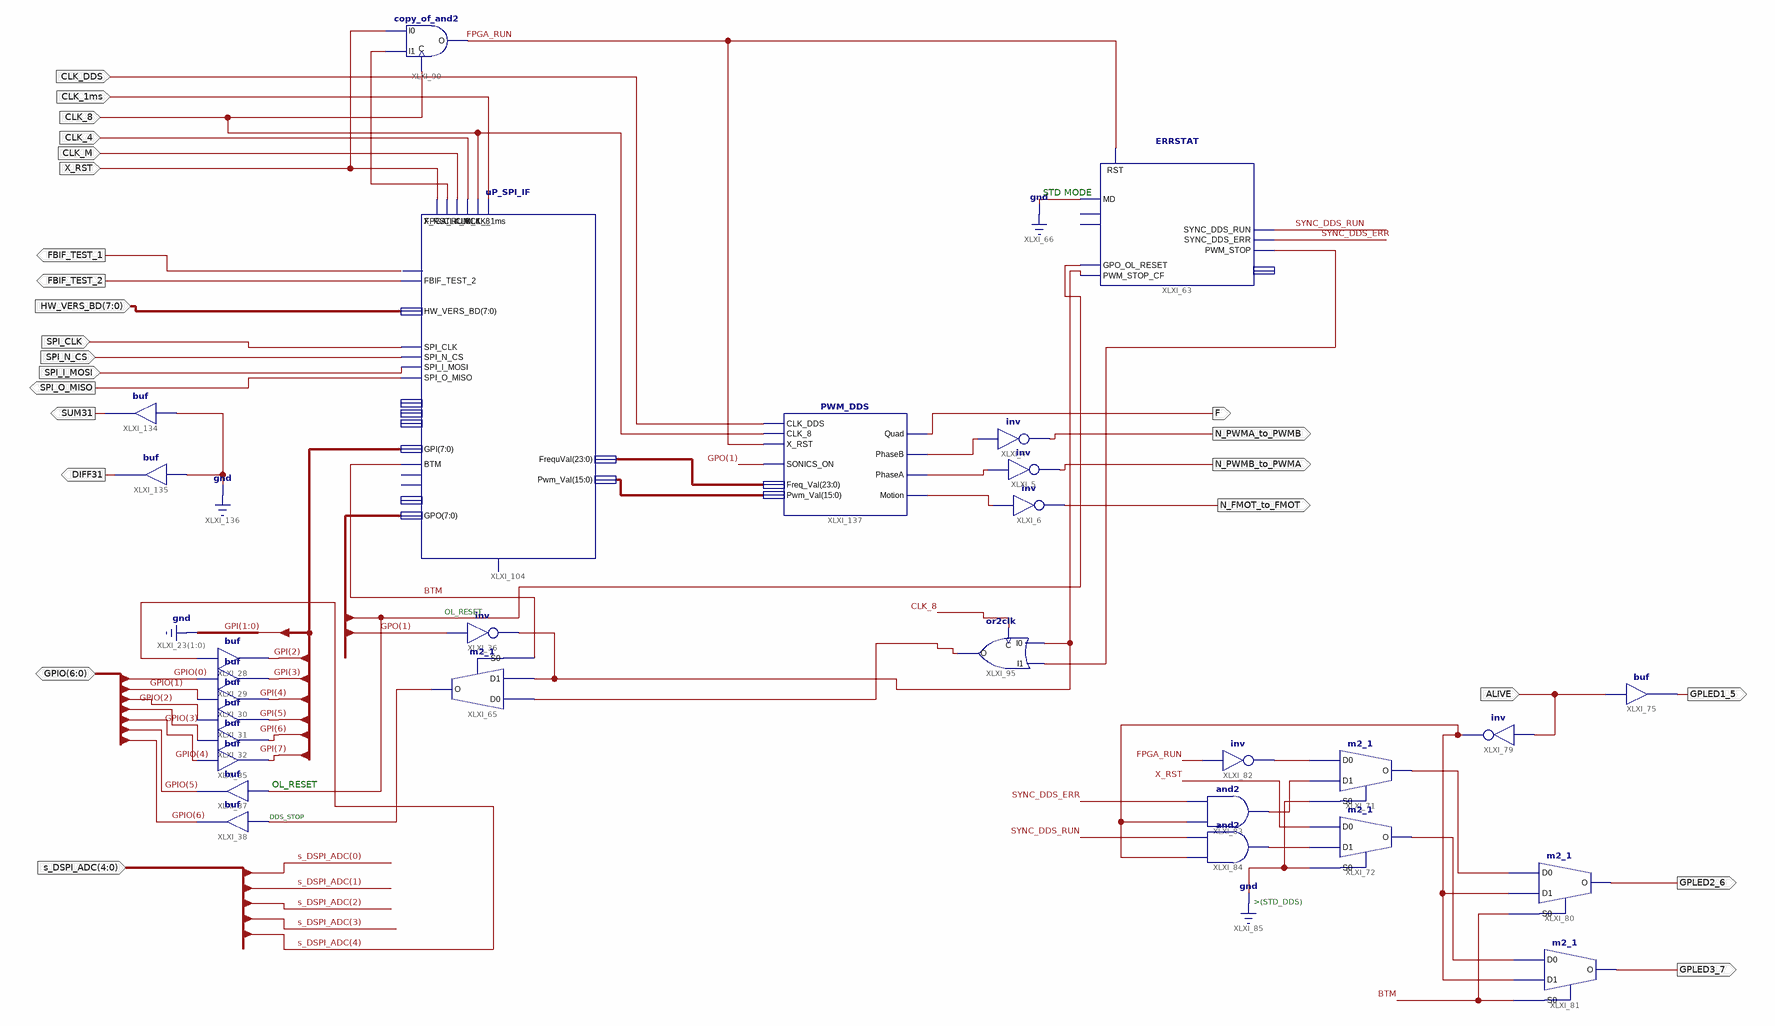
[diagram p0: schematic sheet 1]
// Xilinx ISE schematic FPGA_DUPS_Main.sch (spartan3a) as structural Verilog: 29 symbols, 25 ports
module FPGA_DUPS_Main (
  input  X_RST,
  input  CLK_M,
  input  CLK_4,
  input  CLK_8,
  input  CLK_1ms,
  input  CLK_DDS,
  input  [7:0] HW_VERS_BD,
  input  SPI_CLK,
  input  SPI_N_CS,
  input  SPI_I_MOSI,
  input  [4:0] s_DSPI_ADC,
  input  ALIVE,
  inout  [6:0] GPIO,
  output SPI_O_MISO,
  output N_FMOT_to_FMOT,
  output N_PWMB_to_PWMA,
  output N_PWMA_to_PWMB,
  output F,
  output GPLED1_5,
  output GPLED2_6,
  output GPLED3_7,
  output FBIF_TEST_1,
  output FBIF_TEST_2,
  output SUM31,
  output DIFF31
);

  wire BTM, FPGA_RUN, SYNC_DDS_ERR, SYNC_DDS_RUN, XLXN_168, XLXN_204, XLXN_221, XLXN_226, XLXN_236, XLXN_242,
       XLXN_259, XLXN_260, XLXN_267, XLXN_268, XLXN_271, XLXN_281, XLXN_283, XLXN_284;
  wire [7:0] GPO;
  wire [7:2] GPI;
  wire [15:0] XLXN_276;
  wire [23:0] XLXN_277;

  buf XLXI_28 (GPI[2], s_DSPI_ADC[4]);
  buf XLXI_29 (GPI[3], GPIO[0]);
  buf XLXI_30 (GPI[4], GPIO[1]);
  buf XLXI_31 (GPI[5], GPIO[2]);
  buf XLXI_32 (GPI[6], GPIO[3]);
  buf XLXI_35 (GPI[7], GPIO[4]);
  not XLXI_36 (XLXN_204, GPO[1]);
  buf XLXI_37 (GPIO[5], GPO[0]);
  buf XLXI_38 (GPIO[6], XLXN_226);
  not XLXI_6 (N_FMOT_to_FMOT, XLXN_284);
  not XLXI_5 (N_PWMB_to_PWMA, XLXN_283);
  not XLXI_4 (N_PWMA_to_PWMB, XLXN_281);
  ERRSTAT XLXI_63 (
    .MD(1'b0), .RST(FPGA_RUN), .PWM_STOP_CF(XLXN_204), .GPO_OL_RESET(GPO[0]), .SYNC_DDS_RUN(SYNC_DDS_RUN),
    .SYNC_DDS_ERR(SYNC_DDS_ERR), .PWM_STOP(XLXN_221));  // open: FSYNC_VAL_VALID, PHA_VAL_VALID, S_StatHdx
  buf XLXI_75 (GPLED1_5, ALIVE);
  m2_1 XLXI_71 (.D0(XLXN_242), .D1(XLXN_267), .S0(1'b0), .O(XLXN_259));
  m2_1 XLXI_72 (.D0(X_RST), .D1(XLXN_268), .S0(1'b0), .O(XLXN_260));
  not XLXI_79 (XLXN_236, ALIVE);
  m2_1 XLXI_80 (.D0(XLXN_259), .D1(XLXN_236), .S0(BTM), .O(GPLED2_6));
  m2_1 XLXI_81 (.D0(XLXN_260), .D1(XLXN_236), .S0(BTM), .O(GPLED3_7));
  not XLXI_82 (XLXN_242, FPGA_RUN);
  and XLXI_83 (XLXN_267, XLXN_236, SYNC_DDS_ERR);
  and XLXI_84 (XLXN_268, XLXN_236, SYNC_DDS_RUN);
  copy_of_and2 XLXI_90 (.I0(X_RST), .I1(XLXN_168), .O(FPGA_RUN), .C(CLK_8));
  or2clk XLXI_95 (.I1(XLXN_221), .O(XLXN_271), .I0(XLXN_204), .C(CLK_8));
  uP_SPI_IF XLXI_104 (
    .CLK_1ms(CLK_1ms), .CLK_4(CLK_4), .CLK_8(CLK_8), .CLK_M(CLK_M), .GPI({GPI, 2'b00}),
    .HW_VERS_BD(HW_VERS_BD), .SPI_CLK(SPI_CLK), .SPI_I_MOSI(SPI_I_MOSI), .SPI_N_CS(SPI_N_CS), .X_RST(X_RST),
    .BTM(BTM), .FBIF_TEST_1(FBIF_TEST_1), .FBIF_TEST_2(FBIF_TEST_2), .FPGA_RUN(XLXN_168),
    .FrequVal(XLXN_277), .GPO(GPO), .Pwm_Val(XLXN_276), .SPI_O_MISO(SPI_O_MISO));  // open: ADC_ERROR, RCYC_STAT_FrequValOut, RCYC_S_PhaseValOut, RCYC_S_StatHdx, BTM_GPO, BTM_PWMA, BTM_PWMB
  buf XLXI_134 (SUM31, 1'b0);
  buf XLXI_135 (DIFF31, 1'b0);
  PWM_DDS XLXI_137 (
    .CLK_DDS(CLK_DDS), .Motion(XLXN_284), .PhaseA(XLXN_283), .PhaseB(XLXN_281), .Quad(F), .Pwm_Val(XLXN_276),
    .Freq_Val(XLXN_277), .X_RST(FPGA_RUN), .CLK_8(CLK_8), .SONICS_ON(GPO[1]));
  m2_1 XLXI_65 (.D0(XLXN_271), .D1(XLXN_204), .S0(BTM), .O(XLXN_226));

  // Notes on the sheet:
  //   STD MODE
  //   OL_RESET
  //   OL_RESET
  //   DDS_STOP
  //   >(STD_DDS)
endmodule
